# Altium project TouchButtons.PrjPCB
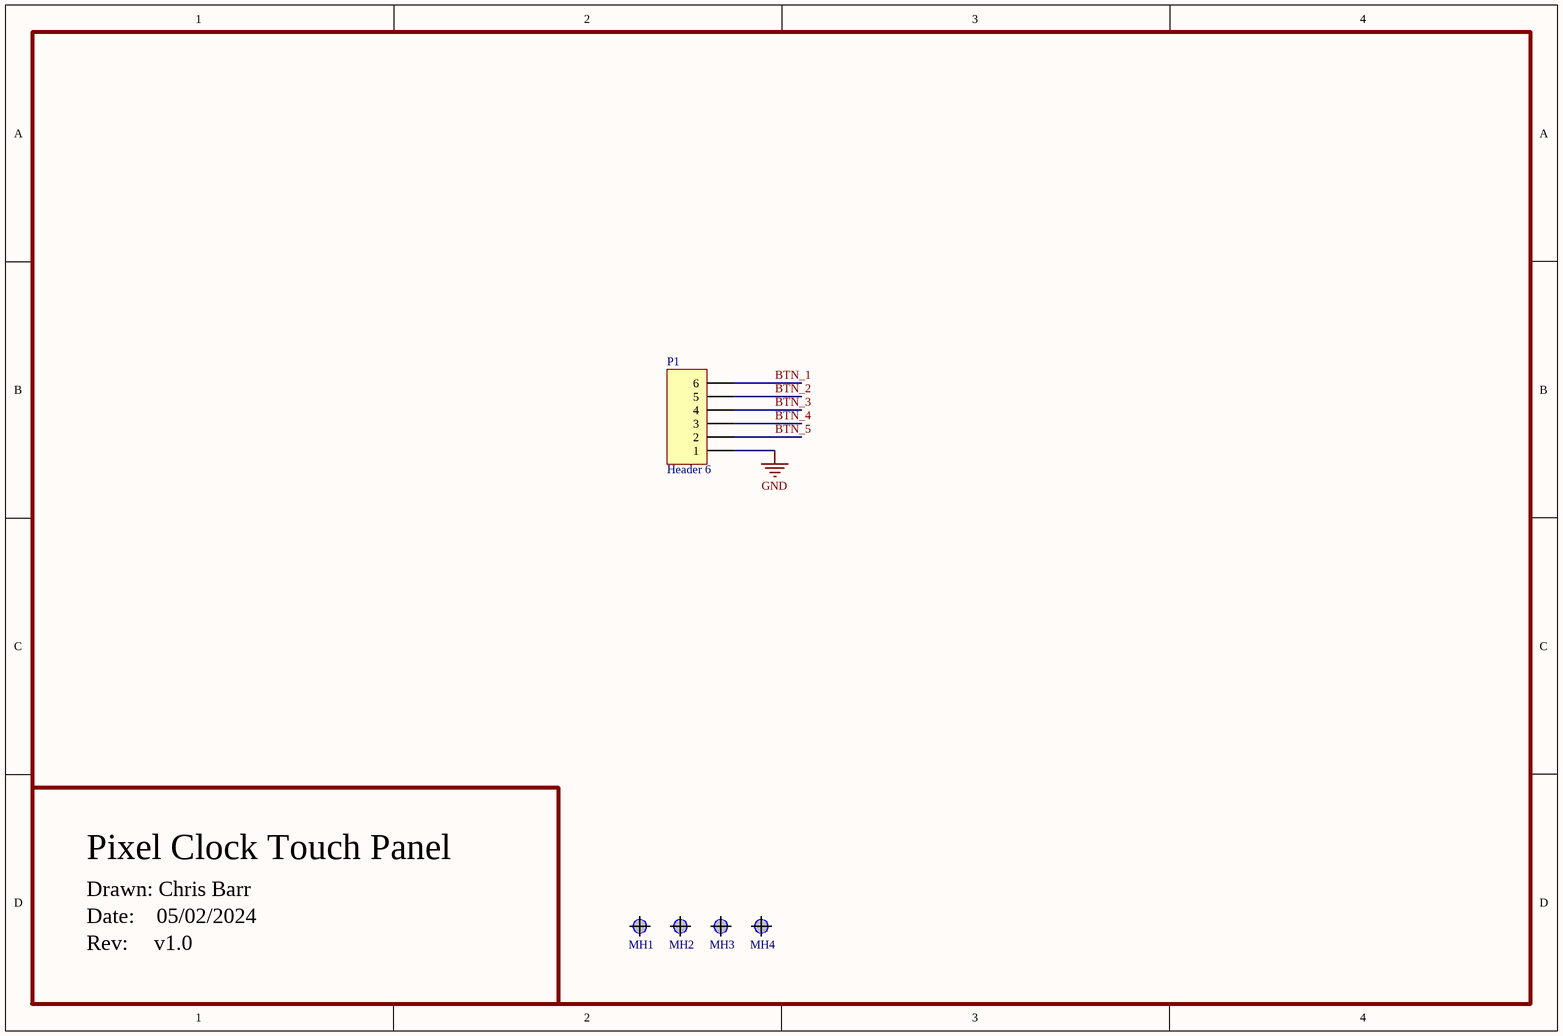
[diagram p0: TouchButtons.SchDoc]
ProjectVersionString: v1.0; ProjectOutputVersion: v1_0; ProjectName: PixelClockTouchPanel
1 sheet, 5 parts. Net scope: global (net labels, ports and power ports of the same name join across sheets).
Board file: TouchButtons.PcbDoc

## Sheet TouchButtons.SchDoc
size A4; PageSetup: Record=PageOptions|CenterHorizontal=True|CenterVertical=True|PrintScale=0.68|XCorrection=1.00|YCorrection=1.00|PrintKind=1|BorderSize=5000000|LeftOffset=0|BottomOffset=0|Orientation=2|PaperLength=1000|PaperWidth=1000|Scale=100|PaperSource=7|PrintQuality=-4|MediaType=1|DitherType=10|PrintScaleMode=1|PaperKind=A3

### Parts
MH1  Screw Hole  [M3-Hole-2]  (value not drawn)  (no BOM)
MH2  Screw Hole  [M3-Hole-2]  (value not drawn)  (no BOM)
MH3  Screw Hole  [M3-Hole-2]  (value not drawn)  (no BOM)
MH4  Screw Hole  [M3-Hole-2]  (value not drawn)  (no BOM)
P1  Header 6  [HDR1X6-HEADER]

### Nets
GND: P1.1
BTN_1: P1.6
BTN_2: P1.5
BTN_3: P1.4
BTN_4: P1.3
BTN_5: P1.2

Not connected (* = marked no-connect by the designer): MH1 M3(0); MH2 M3(0); MH3 M3(0); MH4 M3(0)

### Notes on the sheet
- Date:    05/02/2024
- Pixel Clock Touch Panel
- Drawn: Chris Barr
- Rev:
- Title
- Size:
- Date:
- File:
- A1
- Number:
- Time:
- Revision:
- Sheet
- of

### Library data of the parts
P1 = Header 1X6: Header, 6-Pin; Manufacturer 1: Generic Header; Note: Approved sub OK